# EAGLE design QuizGame2 (EAGLE 9.6.2)
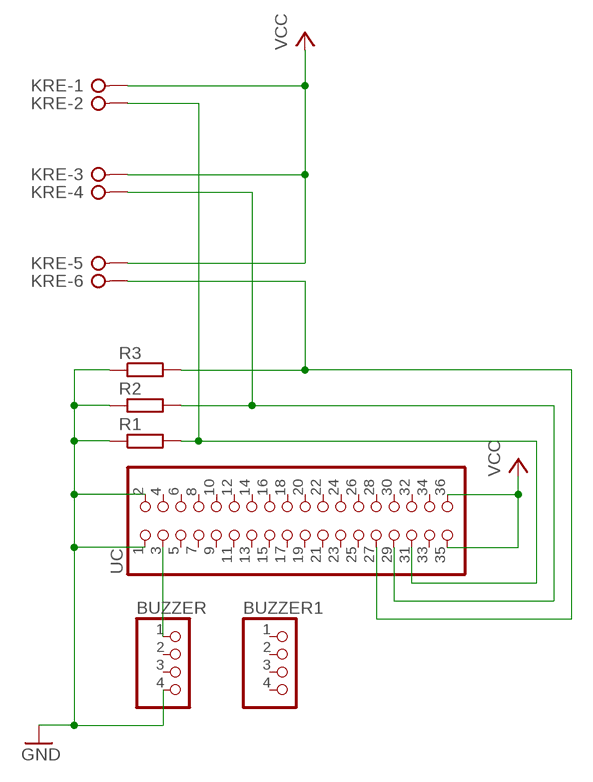
[diagram p0: schematic, sheet 1]

## Parts
BUZZER  PINHD-1X4  [1X04]
BUZZER1  PINHD-1X4  [1X04]
KRE  W237-06P  [W237-6P]
R1  R-EU_0207/12  [0207/12]
R2  R-EU_0207/12  [0207/12]
R3  R-EU_0207/12  [0207/12]
UC  PINHD-2X18  [2X18]

## Nets
GND: BUZZER.4 R1.1 R2.1 R3.1 UC.1 UC.2
N$1: KRE.2 R1.2 UC.31
N$2: KRE.4 R2.2 UC.29
N$3: KRE.6 R3.2 UC.27
N$4: BUZZER.1 UC.3
VCC: KRE.1 KRE.3 KRE.5 UC.35 UC.36
Unconnected: BUZZER1.1 BUZZER1.2 BUZZER1.3 BUZZER1.4 BUZZER.2 BUZZER.3 UC.4 UC.5 UC.6 UC.7 UC.8 UC.9 UC.10 UC.11 UC.12 UC.13 UC.14 UC.15 UC.16 UC.17 UC.18 UC.19 UC.20 UC.21 UC.22 UC.23 UC.24 UC.25 UC.26 UC.28 UC.30 UC.32 UC.33 UC.34

## Library data of the parts
BUZZER BUZZER1 = pinhead:PINHD-1X4: PIN HEADER
KRE = con-wago-508:W237-06P: WAGO SREW CLAMP; OC_FARNELL: unknown; OC_NEWARK: unknown
R1-R3 = rcl:R-EU_: RESISTOR, European symbol; SPICEPREFIX: R
UC = pinhead:PINHD-2X18: PIN HEADER

## Board
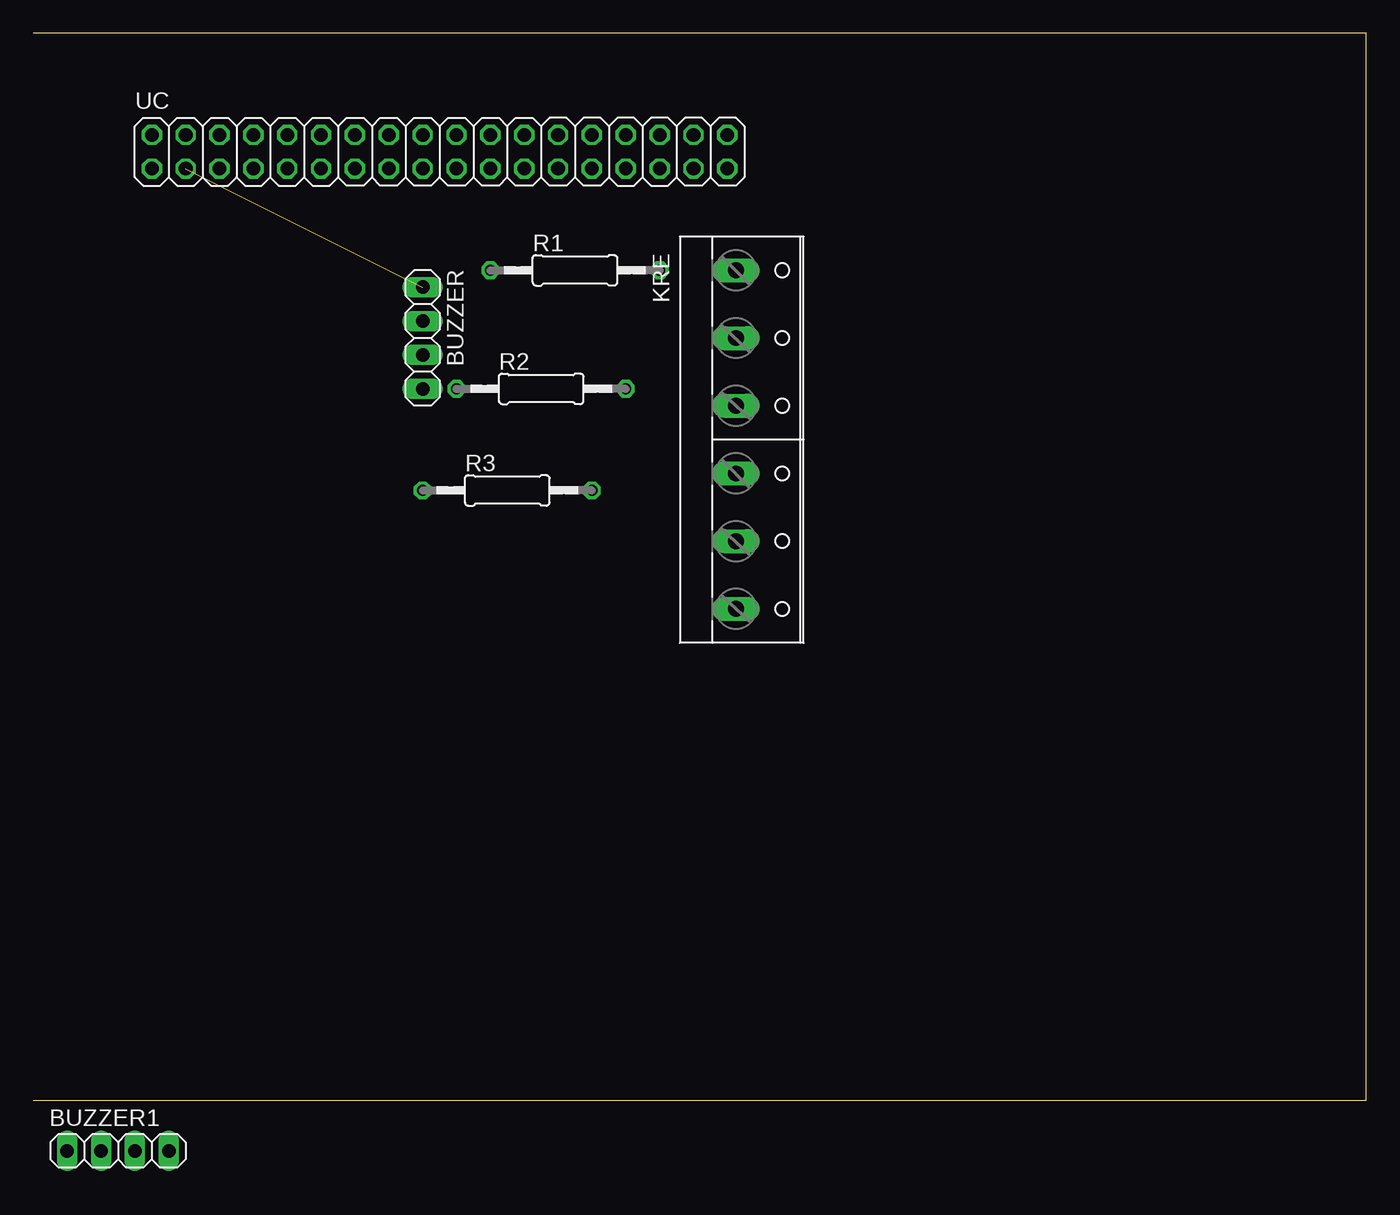
[diagram p1: board, top side]
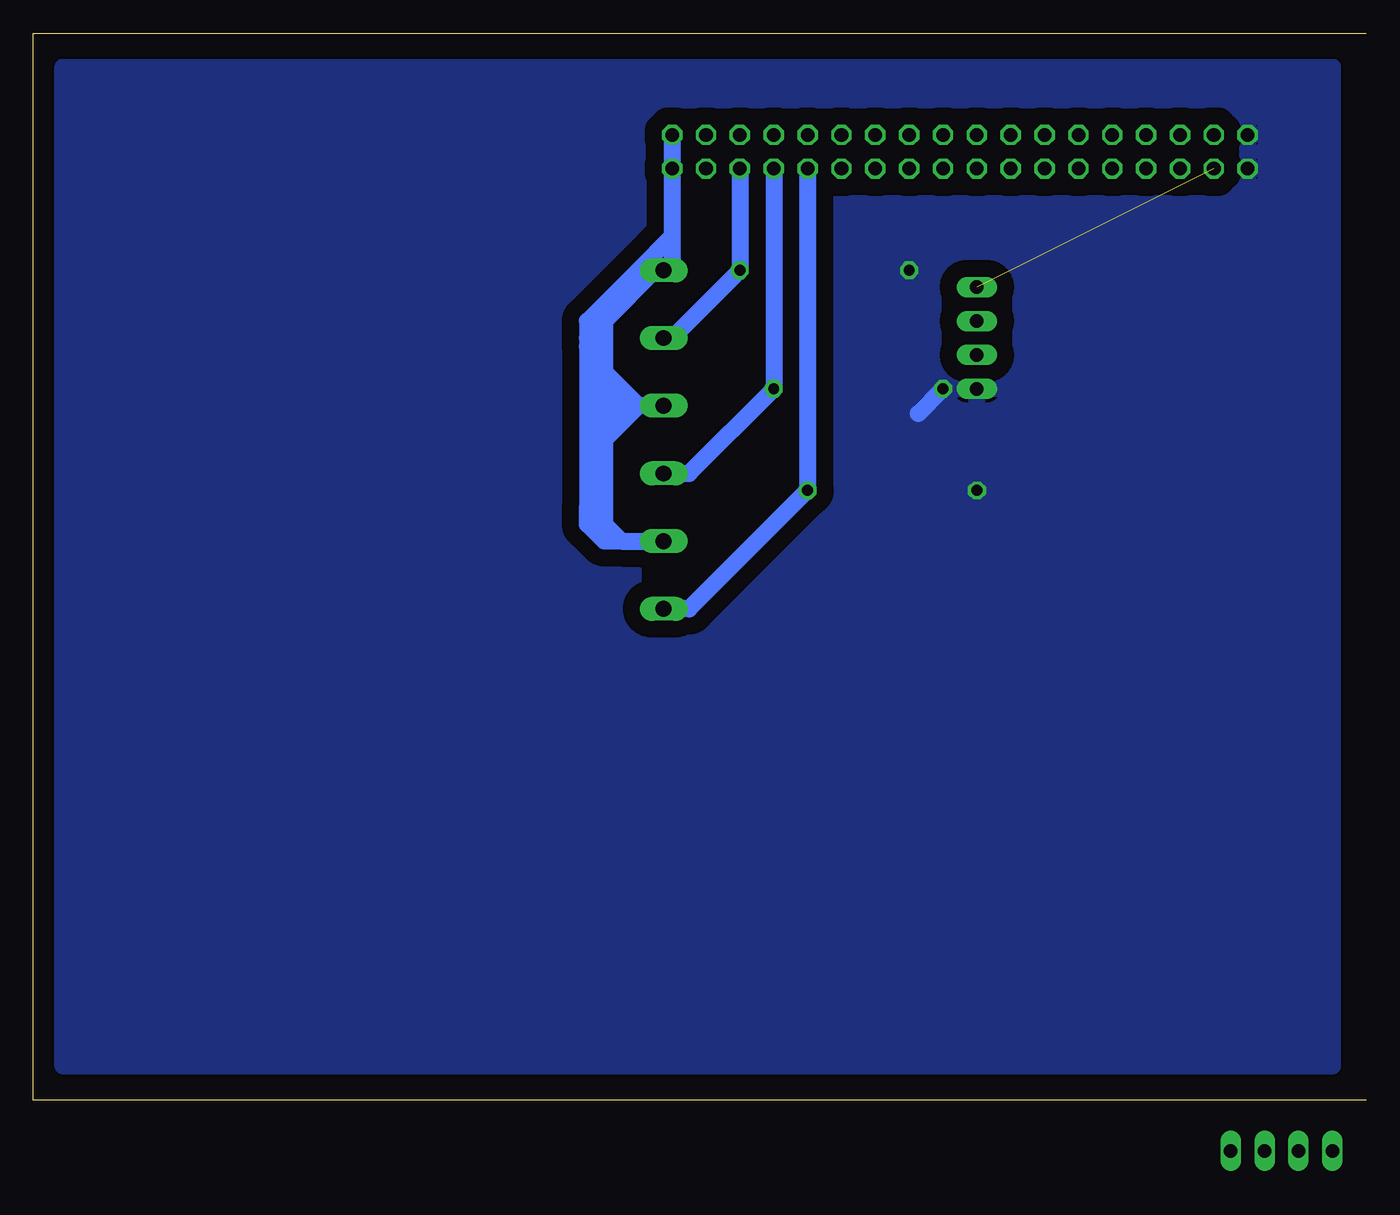
[diagram p2: board, bottom side, seen from below]

Size 100 x 80 mm. Coordinates in mm from the lower left corner, seen from the top.
Outline: 0,0 100,0 100,80 0,80
Copper layers (1*16): Top 0.035mm / dielectric 1.5mm / Bottom 0.035mm
Design rules "default": minimum track width 6mil, minimum drill 0.35mm, track to track 6mil, track to pad 6mil, pad to pad 6mil, via to via 6mil, smd to smd 6mil, copper to edge 40mil, drill to drill 6mil, minimum pad ring 10mil, minimum via ring 8mil, stop-mask expansion 4mil, vias tented up to drill 0mil, thermal gap 10mil

### Footprints (pad centres in the part's own frame; a part is rotated, then mirrored left to right if it is on the bottom)
1X04 = drill 1.016 long: 1 -3.81,0; 2 -1.27,0; 3 1.27,0; 4 3.81,0
W237-6P = drill 1.194 long: 1 -12.7,-0.635; 2 -7.62,-0.635; 3 -2.54,-0.635; 4 2.54,-0.635; 5 7.62,-0.635; 6 12.7,-0.635
0207/12 = drill 0.813 octagon: 1 -6.35,0; 2 6.35,0
2X18 = drill 1.016 octagon: 1 -21.59,-1.27; 2 -21.59,1.27; 3 -19.05,-1.27; 4 -19.05,1.27; 5 -16.51,-1.27; 6 -16.51,1.27; 7 -13.97,-1.27; 8 -13.97,1.27; 9 -11.43,-1.27; 10 -11.43,1.27; 11 -8.89,-1.27; 12 -8.89,1.27; 13 -6.35,-1.27; 14 -6.35,1.27; 15 -3.81,-1.27; 16 -3.81,1.27; 17 -1.27,-1.27; 18 -1.27,1.27; 19 1.27,-1.27; 20 1.27,1.27; 21 3.81,-1.27; 22 3.81,1.27; 23 6.35,-1.27; 24 6.35,1.27; 25 8.89,-1.27; 26 8.89,1.27; 27 11.43,-1.27; 28 11.43,1.27; 29 13.97,-1.27; 30 13.97,1.27; 31 16.51,-1.27; 32 16.51,1.27; 33 19.05,-1.27; 34 19.05,1.27; 35 21.59,-1.27; 36 21.59,1.27

### Placement (x,y rotation side)
BUZZER  29.21,57.15 270 top
BUZZER1  6.35,-3.81 0 top  (outside the outline)
KRE  53.34,49.53 270 top
R1  40.64,62.23 0 top
R2  38.1,53.34 0 top
R3  35.56,45.72 0 top
UC  30.48,71.12 0 top

### Tracks (layer width: path | path; a pad name or v marks a point on that pad's centre or on a via)
GND
  Bottom 1.27: 33.61,51.48 R2.1
  pour Bottom (isolate 1.27): 2.54,77.47 2.54,2.54 97.79,2.54 97.79,77.47
N$1
  Bottom 1.27: UC.31 R1.2 | R1.2 47.03,62.27 | R1.2 52.07,57.15 KRE.2
N$2
  Bottom 1.27: UC.29 R2.2 | R2.2 44.49,53.38 | R2.2 50.8,46.99 KRE.4
N$3
  Bottom 1.27: UC.27 R3.2 50.8,36.83 KRE.6
N$4  (1 unrouted)
VCC
  Bottom 1.27: UC.36 UC.35 52.07,64.77 | 58.42,44.45 57.15,43.18 | 57.15,43.18 55.88,41.91 | 55.88,41.91 KRE.5 | KRE.1 52.07,62.87 52.07,64.77 | 58.42,56.52 58.42,44.45 | 57.15,55.24 58.42,56.52 | KRE.1 53.34,62.23 57.15,58.42 | 58.42,57.15 58.42,56.52 | 57.15,58.42 58.42,57.15 | 57.15,58.42 57.15,55.24 | 57.15,55.24 57.15,54.61 | 57.15,54.61 57.15,49.53 | 57.15,49.53 57.15,43.18 | KRE.1 54.61,62.23 | 54.61,62.23 58.42,58.42 58.42,57.15 | 54.61,62.23 52.07,64.77 | 54.61,52.07 55.88,53.34 | 55.88,53.34 57.15,54.61 | KRE.3 54.61,52.07 | 54.61,52.07 55.88,50.8 | 55.88,50.8 57.15,49.53 | 55.88,53.34 55.88,50.8 | 55.88,41.91 57.15,41.91 58.42,43.18 58.42,44.45